# Altium schematic sheet processingsys.SchDoc
size A4
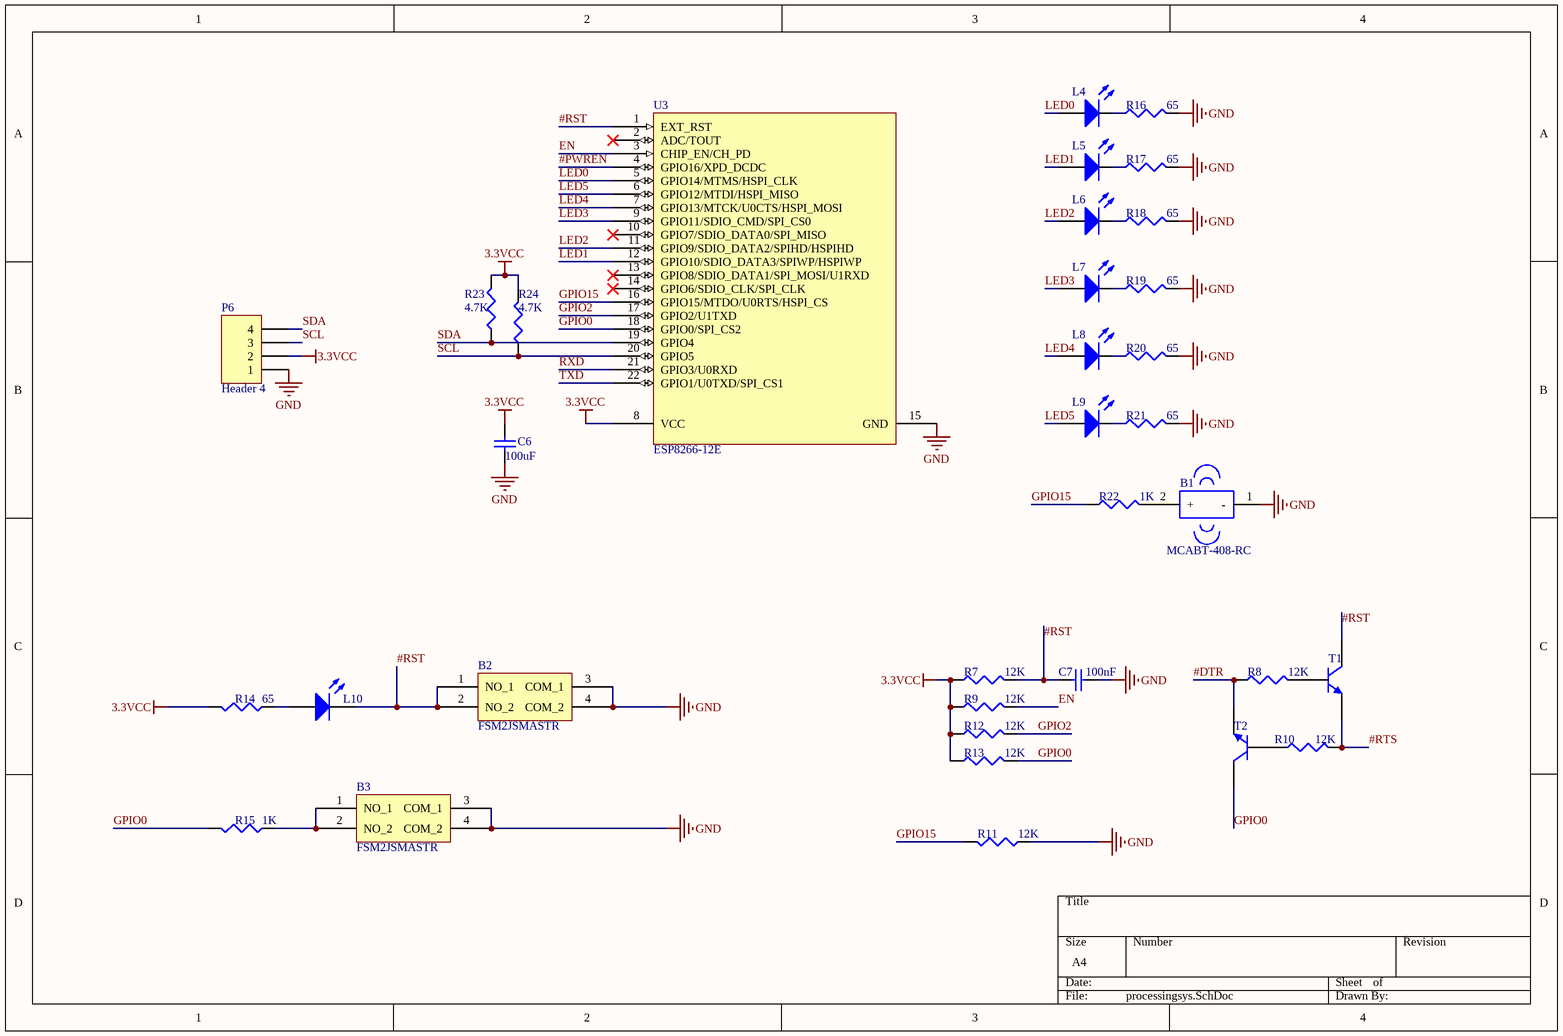
[diagram p0: processingsys.SchDoc]

## Parts
B1  MCABT-408-RC  [MCABT-408-RC]
B2  FSM2JSMASTR  [BUTTON_SMD]
B3  FSM2JSMASTR  [BUTTON_SMD]
C6  value 100uF  [C1206]  (hidden comment: Cap Semi)
C7  value 100nF  [C1206]  (hidden comment: Cap Semi)
L4  KM-23  [SOT-23]  (value not drawn)
L5  KM-23  [SOT-23]  (value not drawn)
L6  KM-23  [SOT-23]  (value not drawn)
L7  KM-23  [SOT-23]  (value not drawn)
L8  KM-23  [SOT-23]  (value not drawn)
L9  KM-23  [SOT-23]  (value not drawn)
L10  KM-23  [SOT-23]  (value not drawn)
P6  Header 4  [HDR1X4]
R7  value 12K  [J1-0603]  (hidden comment: Res3)
R8  value 12K  [J1-0603]  (hidden comment: Res3)
R9  value 12K  [J1-0603]  (hidden comment: Res3)
R10  value 12K  [J1-0603]  (hidden comment: Res3)
R11  value 12K  [J1-0603]  (hidden comment: Res3)
R12  value 12K  [J1-0603]  (hidden comment: Res3)
R13  value 12K  [J1-0603]  (hidden comment: Res3)
R14  value 65  [J1-0603]  (hidden comment: Res3)
R15  value 1K  [J1-0603]  (hidden comment: Res3)
R16  value 65  [J1-0603]  (hidden comment: Res3)
R17  value 65  [J1-0603]  (hidden comment: Res3)
R18  value 65  [J1-0603]  (hidden comment: Res3)
R19  value 65  [J1-0603]  (hidden comment: Res3)
R20  value 65  [J1-0603]  (hidden comment: Res3)
R21  value 65  [J1-0603]  (hidden comment: Res3)
R22  value 1K  [J1-0603]  (hidden comment: Res3)
R23  value 4.7K  [J1-0603]  (hidden comment: Res3)
R24  value 4.7K  [J1-0603]  (hidden comment: Res3)
T1  SBC846BWT1G  [SOT-323]  (value not drawn)
T2  SBC846BWT1G  [SOT-323]  (value not drawn)
U3  ESP8266-12E  [ESP8266-12E]

## Nets
3.3VCC: C6.2 P6.2 R7.1 R9.1 R12.1 R13.1 R14.2 R23.2 R24.2 U3.8(VCC)
GND: B1.1(-) B2.3(COM_1) B2.4(COM_2) B3.3(COM_1) B3.4(COM_2) C6.1 C7.1 P6.1 R11.1 R16.2 R17.2 R18.2 R19.2 R20.2 R21.2 U3.15(GND)
#DTR: R8.1 T2.2(E)
#PWREN: U3.4(GPIO16/XPD_DCDC)
#RST: B2.1(NO_1) B2.2(NO_2) C7.2 L10.3(K) R7.2 T1.3(C) U3.1(EXT_RST)
#RTS: R10.2 T1.2(E)
EN: R9.2 U3.3(CHIP_EN/CH_PD)
GPIO0: R13.2 R15.2 T2.3(C) U3.18(GPIO0/SPI_CS2)
GPIO2: R12.2 U3.17(GPIO2/U1TXD)
GPIO15: R11.2 R22.1 U3.16(GPIO15/MTDO/U0RTS/HSPI_CS)
LED0: L4.1(A) U3.5(GPIO14/MTMS/HSPI_CLK)
LED1: L5.1(A) U3.12(GPIO10/SDIO_DATA3/SPIWP/HSPIWP)
LED2: L6.1(A) U3.11(GPIO9/SDIO_DATA2/SPIHD/HSPIHD)
LED3: L7.1(A) U3.9(GPIO11/SDIO_CMD/SPI_CS0)
LED4: L8.1(A) U3.7(GPIO13/MTCK/U0CTS/HSPI_MOSI)
LED5: L9.1(A) U3.6(GPIO12/MTDI/HSPI_MISO)
RXD: U3.21(GPIO3/U0RXD)
SCL: P6.3 R24.1 U3.20(GPIO5)
SDA: P6.4 R23.1 U3.19(GPIO4)
TXD: U3.22(GPIO1/U0TXD/SPI_CS1)
NetB1_2: B1.2(+) R22.2
NetB3_1: B3.1(NO_1) B3.2(NO_2) R15.1
NetL4_3: L4.3(K) R16.1
NetL5_3: L5.3(K) R17.1
NetL6_3: L6.3(K) R18.1
NetL7_3: L7.3(K) R19.1
NetL8_3: L8.3(K) R20.1
NetL9_3: L9.3(K) R21.1
NetL10_1: L10.1(A) R14.1
NetR8_2: R8.2 T1.1(B)
NetR10_1: R10.1 T2.1(B)

Not connected (* = marked no-connect by the designer): U3 2(ADC/TOUT)* 10(GPIO7/SDIO_DATA0/SPI_MISO)* 13(GPIO8/SDIO_DATA1/SPI_MOSI/U1RXD)* 14(GPIO6/SDIO_CLK/SPI_CLK)*

## Library data of the parts
B1 = MCABT-408-RC: ransductor, 1 V a 3 V, 85 dBA, Sirena, 70 mA; ComponentLink1Description: farnell; ComponentLink1URL: https://es.farnell.com/multicomp/mcabt-408-rc/ac-stico-electro-mech-audio-1/dp/2361105?krypto=Kzr7701dNdWkobLwazw2WAHmNHziskZrQMg7S%2Faf%2BaL%2F%2Bj%2FkWh1M3S1k%2FYSHSKSx0MzERa16wH8IxUPYeDKx2PmCEW9b7Qq2dWm4YJR83SHnond9nZgPFyrqEJusaoJIK60fC%2FoQdI36P39N2BQPzNsuueVDbqXwGAOKtHeDF30EVb%2FMeWA5wOoM2bNdaZFSgNjAKDp4mZigEnbiecpx7MGL6JOzzhP9BWUiYbys6ks5dt9LMNmTnpFtdjo7H2akCj%2F%2BfLNG71ArvMaoxZ0WMv4hKuovOAWfA3NHFC9HmqzoIwqKqKgSbKZowJ%2Btqn8YlCHLgv9T7vbfNqK3ZjJzUnVd%2FT%2BsNsbTS0FSkhssYu9EDD5ZGkWROWS0H93J6TpgHhXKvnZj%2BSUvRf0Y%2Bf3ZsPXOKqdIdoKAc%2FpA98XWUfDfcYNhjP%2Fdf3fuxTewHmiKE8rVjXfHvkQUwmS1KThmixSSWsU6BPdfoeHtQ48EBKM%3D&ddkey=https%3Aes-ES%2FElement14_Spain%2Fsearch
B2 B3 = FSM2JSMASTR: TE Connectivity - Interruptor Táctil, Montaje Superficial (SMD); ComponentLink1Description: farnell; ComponentLink1URL: https://es.farnell.com/alcoswitch-te-connectivity/fsm2jsmastr/interruptor-t-ctil-spst-0-05a/dp/2610941?krypto=STQKwvVYAPccPvWo2qKFm%2B2gHuVF7WkaqIiu7Dm0cJ5iCIeV7DHhPViRfCOgoFsJStXtod%2BnIQ%2BYkMVEvW6iM3AuzhepTn6uOw1UVwc7VB8KUrNLl0uQiR%2Bt35da8c9%2BQU171xU6PFtEc8EnsSVD6zTrAoZNeFTntAPThe1lSw75SwgbO5cQ33JndyglwNSD%2Fmpse8Gtvc2qmuIyzAgV9svHZkncDZZX6ZXbcKP216NPBEjbrtNYbKi2SeLDw4XeR8vtbf5NJKVxMUwbBhIrG2GTfYXybkb4t0M%2BFUX2Mjpm2Pqiy7%2FaHyLXsF%2F6JqWeJ%2FtTnNjkvf4o7u918wSV9RxDYtXvBiLcNJGrHbUuu6%2BAwcACzT8Mk6xWTk1NrmLNmfrigBPTmYlqdrRkSyqTCN5s9fVyopuyy4jhDrGN6PxrQet12eg7oAfq92u%2FGproWwHxsaTab23LGvFEnuMkIb5ATL7w%2Fr2VOeHmcwkXp7E%3D&ddkey=https%3Aes-ES%2FElement14_Spain%2Fsearch
C6 C7 = Cap Semi: Capacitor (Semiconductor SIM Model); Published: 8-Jun-2000; LatestRevisionDate: 29-May-2009; LatestRevisionNote: IPC-7351 Footprint Added.; PackageReference: C1206; Publisher: Altium Limited; PackageDescription: Chip Capacitor
L4-L10 = KM-23: Kingbright - LED, SOT-23; ComponentLink1Description: farnell -RED; ComponentLink1URL: https://es.farnell.com/kingbright/km-23id-f/led-red-sot-23-smd/dp/2099216?st=KM-23ID; ComponentLink2Description: farnell-Green; ComponentLink2URL: https://es.farnell.com/kingbright/km-23sgd-f/led-green-sot-23-smd/dp/2099217?st=KM-23
P6 = Header 4: Header, 4-Pin; LatestRevisionDate: 17-Jul-2002; LatestRevisionNote: Re-released for DXP Platform.; Publisher: Altium Limited
R7-R24 = Res3: Resistor; Published: 8-Jun-2000; LatestRevisionDate: 29-May-2009; LatestRevisionNote: IPC-7351 Footprint Added.; PackageReference: J1-0603; Publisher: Altium Limited; PackageDescription: Chip Resistor
T1 T2 = SBC846BWT1G: ON SEMICONDUCTOR - SBC846BWT1G - TRANSISTOR, BIPOL, NPN, 65V; ComponentLink1Description: farnell; ComponentLink1URL: https://es.farnell.com/on-semiconductor/sbc846bwt1g/transistor-bipolar-npn-65-v/dp/2533346?st=SBC846BWT1G